# EAGLE design Alimentatore (EAGLE 4.14)
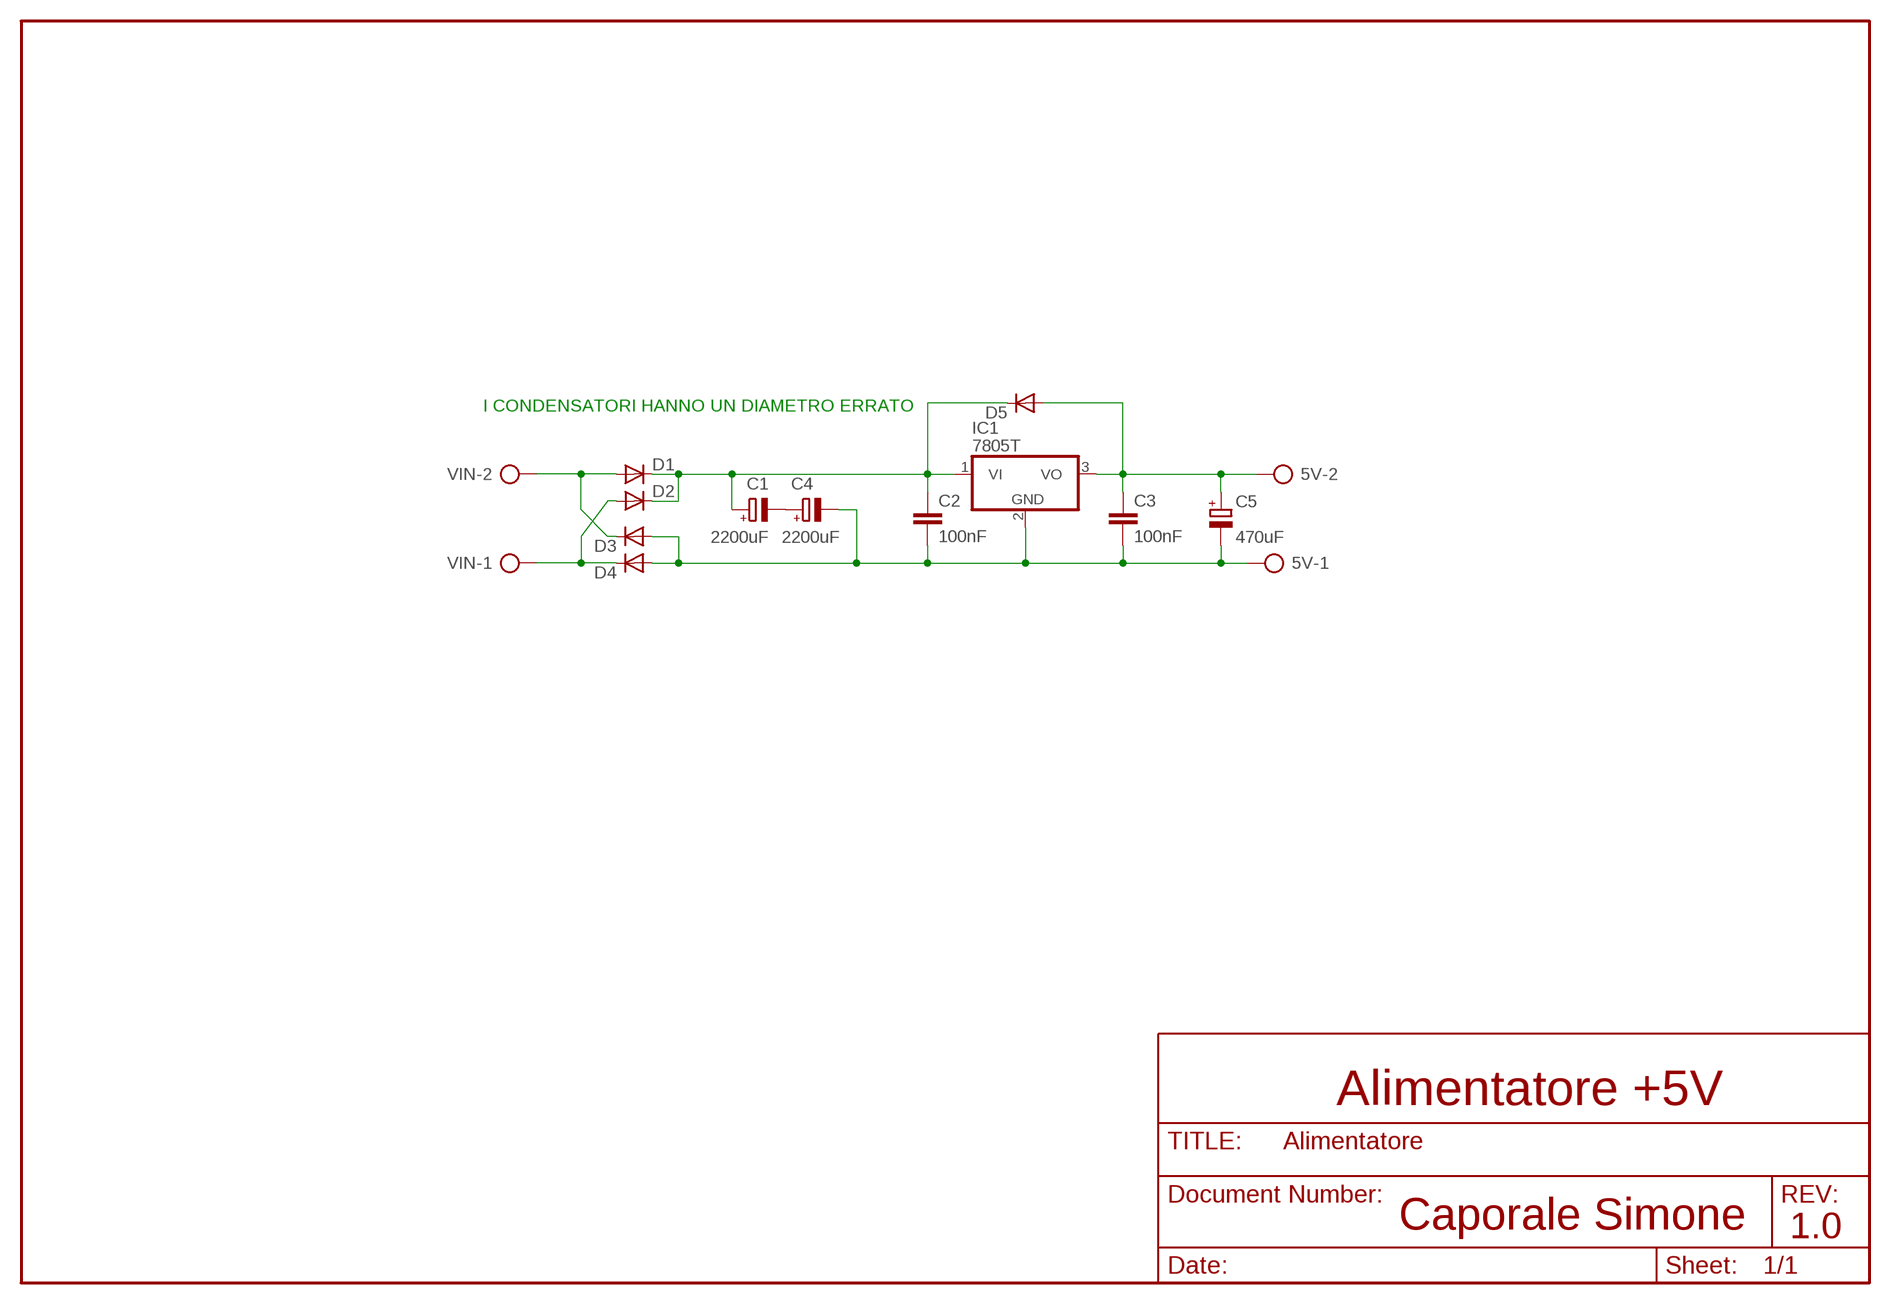
[diagram p0: schematic, sheet 1]

## Parts
5V  AK500/2-H  [AK500/2-H]
C1  2200uF  CPOL-EUE5-8.5  [E5-8,5]
C2  100nF  C5/3.5  [C5B3.5]
C3  100nF  C5/3.5  [C5B3.5]
C4  2200uF  CPOL-EUE5-8.5  [E5-8,5]
C5  470uF  CPOL-EUE5-8.5  [E5-8,5]
D1  1N4004  [DO41-10]
D2  1N4004  [DO41-10]
D3  1N4004  [DO41-10]
D4  1N4004  [DO41-10]
D5  1N4004  [DO41-10]
IC1  7805T  [TO220H]
VIN  AK500/2-H  [AK500/2-H]

## Nets
N$1: D1.A D3.C VIN.2
N$2: D2.A D4.C VIN.1
N$3: 5V.2 C3.1 C5.+ D5.A IC1.3(VO)
N$4: C1.- C4.+
N$7: C1.+ C2.1 D1.C D2.C D5.C IC1.1(VI)
N$8: 5V.1 C2.2 C3.2 C4.- C5.- D3.A D4.A IC1.2(GND)

## Notes on the sheet
- I CONDENSATORI HANNO UN DIAMETRO ERRATO
- Alimentatore +5V
- Caporale Simone | 1.0

## Library data of the parts
5V VIN = con-ptr500:AK500/2-H: CONNECTOR Aug. 2004 / PTR Meßtechnik: Die Bezeichnung der Serie AK505 wurde geändert. Es handelt sich hierbei um AK500 in horizontaler Ausführung.
C1 C4 C5 = rcl:CPOL-EU: POLARIZED CAPACITOR, European symbol
C2 C3 = capacitor-wima:C: CAPACITOR naming: grid - package width
D1-D5 = diode:1N4004: DIODE general purpose rectifier, 1 A
IC1 = linear:78*: Positive VOLTAGE REGULATOR Source: http://cache.national.com/ds/LM/LM78L05.pdf http://www.fairchildsemi.com/ds/LM/LM7805.pdf

## Net classes
0 default: width 0.406 mm, clearance 0.61 mm

## Board
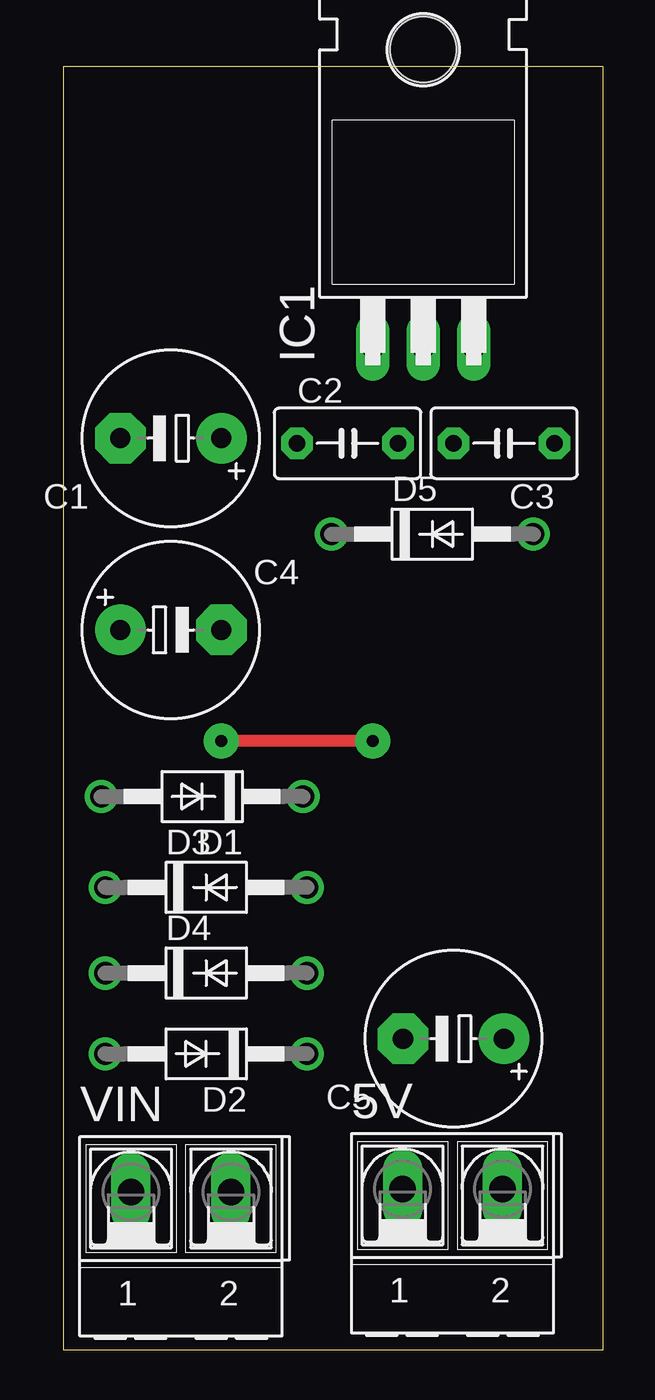
[diagram p1: board, top side]
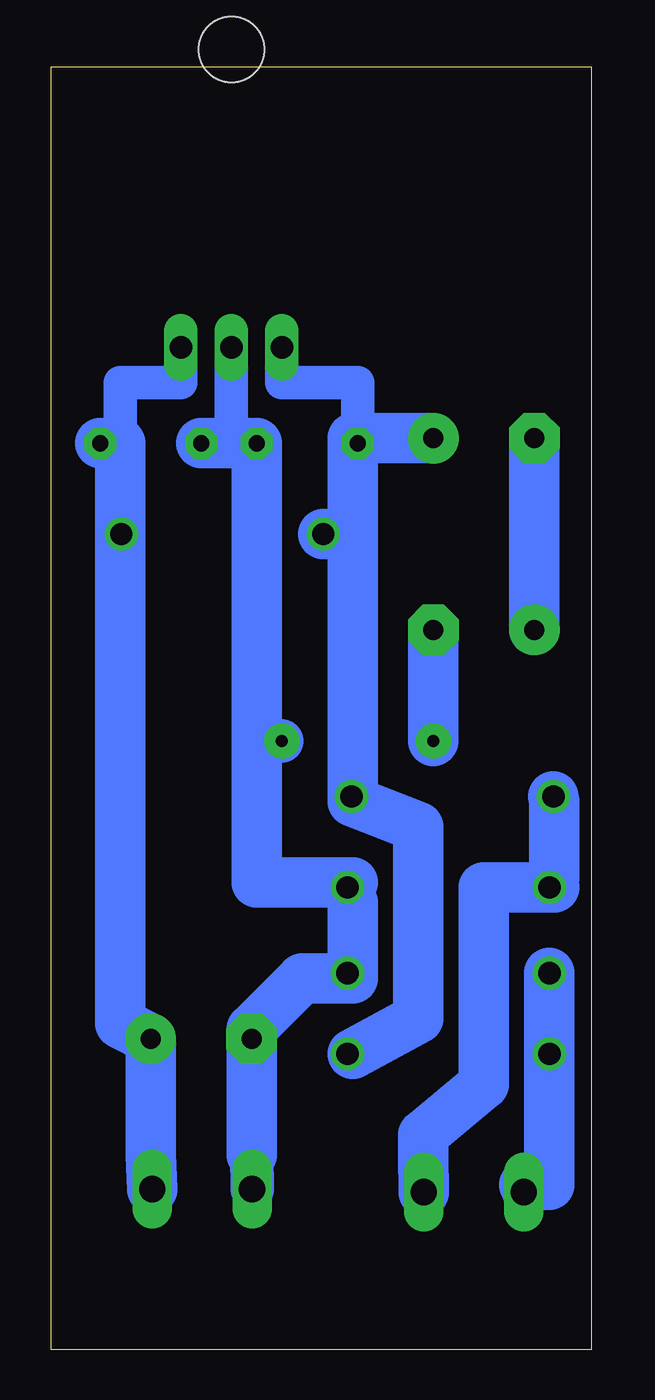
[diagram p2: board, bottom side, seen from below]

Size 27.16 x 64.59 mm. Coordinates in mm from the lower left corner, seen from the top.
Outline: 0,0 27.16,0 27.16,64.59 0,64.59 0,0
Copper layers (1*16): Top 0.035mm / dielectric 1.5mm / Bottom 0.035mm
Design rules "default": minimum track width 50mil, minimum drill 24mil, track to track 8mil, track to pad 8mil, pad to pad 8mil, via to via 8mil, smd to smd 8mil, copper to edge 40mil, drill to drill 8mil, minimum pad ring 10mil, minimum via ring 8mil, stop-mask expansion 4mil, vias tented up to drill 0mil, thermal gap 10mil

### Footprints (pad centres in the part's own frame; a part is rotated, then mirrored left to right if it is on the bottom)
AK500/2-H = drill 1.321 long: 1 -2.515,0; 2 2.515,0
E5-8,5 = drill 1.016 pad 2.54 round: + -2.54,0 | drill 1.016 pad 2.54 octagon: - 2.54,0
C5B3.5 = drill 0.813 pad 1.6 octagon: 1 -2.54,0; 2 2.54,0
DO41-10 = drill 1.118 round: A 5.08,0; C -5.08,0
TO220H = drill 1.118 long: 1 -2.54,-10.16; 2 0,-10.16; 3 2.54,-10.16 | hole 3.302: 0,4.826

### Placement (x,y rotation side)
5V  19.58,8.09 0 top
C1  5.41,45.89 180 top
C2  14.3,45.63 0 top
C3  22.17,45.63 180 top
C4  5.41,36.23 0 top
C5  19.63,15.66 180 top
D1  6.98,27.85 180 top
D2  7.18,14.9 180 top
D3  7.18,23.28 0 top
D4  7.18,18.96 0 top
D5  18.56,41.06 0 top
IC1  18.11,60.62 0 top
VIN  5.91,7.94 0 top

### Tracks (layer width: path | path; a pad name or v marks a point on that pad's centre or on a via)
N$1
  Bottom 2.184: D3.C 1.85,23.79
  Bottom 2.54: 1.85,23.79 1.85,27.6 D1.A | VIN.2 8.45,9.82 8.45,10.83 5.41,13.37 5.41,23.28 D3.C 1.85,23.28
N$2
  Bottom 1.93: 3.37,8.29 3.37,7.94
  Bottom 2.184: 3.37,7.94 VIN.1
  Bottom 2.54: D4.C D2.A 2.1,8.29 3.37,8.29
N$3
  Bottom 1.27: 23.69,41.06 D5.A
  Bottom 1.676: IC1.3 20.65,48.68 23.69,48.68 23.69,45.63
  Bottom 2.54: 5V.2 22.17,9.82 C5.+ 23.69,16.42 23.69,41.06 23.69,45.63 C3.1
N$4
  Bottom 2.54: C4.+ C1.-
N$7
  Bottom 1.27: 12.01,45.89 C2.1 | 12.01,27.6 D1.C
  Bottom 1.676: IC1.1 15.57,48.68 11.76,48.68 C2.1
  Bottom 1.93: D2.C 12.01,14.9
  Bottom 2.54: 12.01,14.9 8.71,16.68 8.71,26.33 12.01,27.6 12.01,41.06 | C1.+ 12.01,45.89 12.01,41.06 | 12.01,41.06 D5.C
N$8  (via drill 0.6 pad 1.78)
  Top 0.61: v15.57,30.65 v7.95,30.65
  Bottom 1.27: 12.01,22.52 D3.A 12.01,23.53 | 12.01,18.71 D4.A | C4.- 8.2,36.23
  Bottom 1.676: 18.11,45.63 IC1.2
  Bottom 2.184: 5V.1 17.09,9.82 | C5.- 17.09,16.17 | 16.84,30.65 v15.57,30.65
  Bottom 2.54: 12.01,22.52 12.01,18.71 14.55,18.71 17.09,16.17 | C3.2 18.11,45.63 C2.2 16.84,30.65 16.84,23.53 12.01,23.53 | 17.09,9.82 C5.- | v7.95,30.65 C4.-

### Text on the board
Top: I CONDENSATORI HANNO UN DIAMETRO ERRATO